# EAGLE design LV Parallel IO Card (EAGLE 4.16)
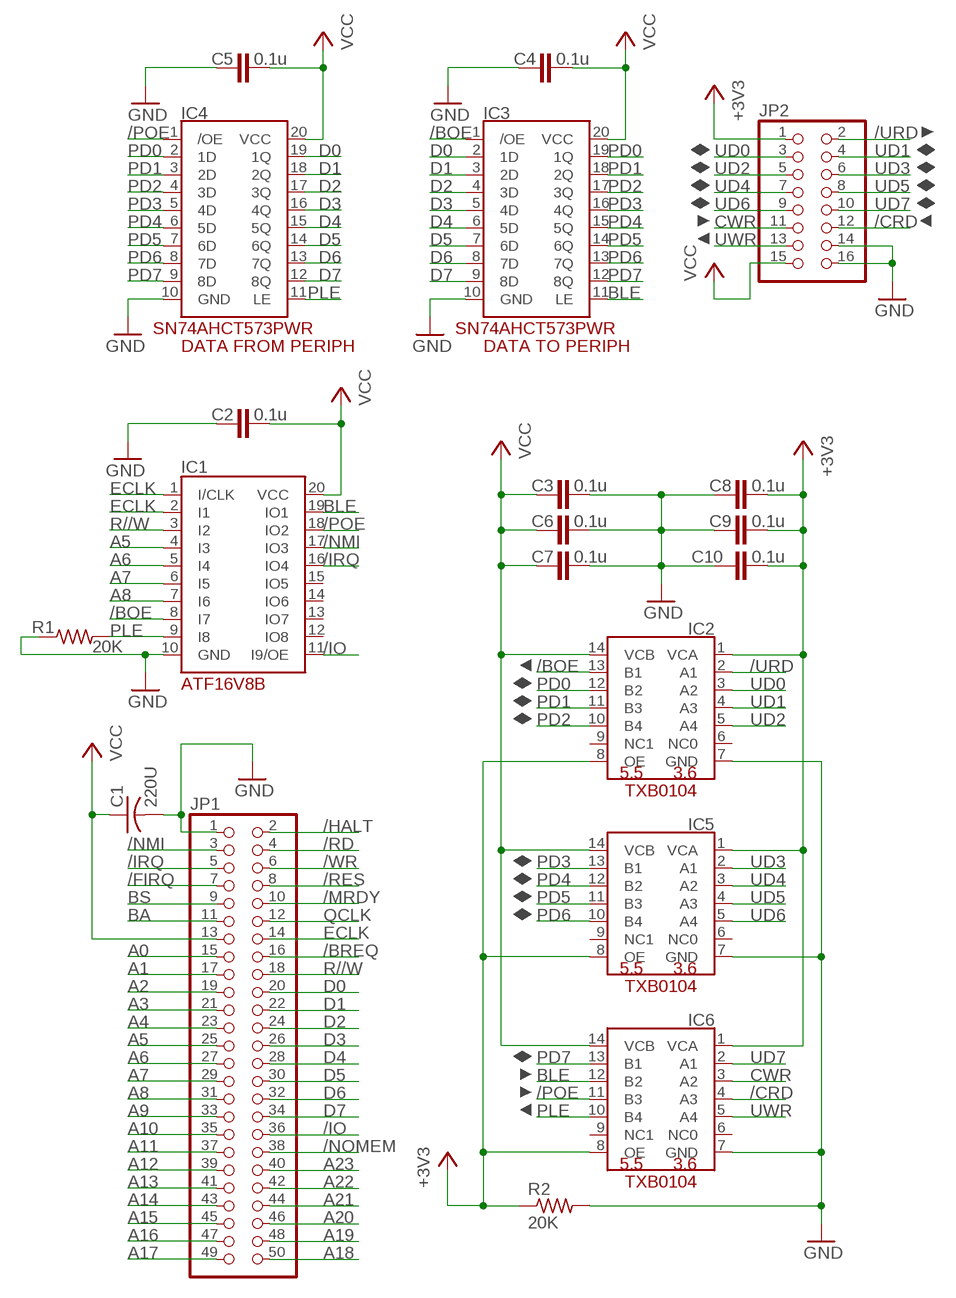
[diagram p0: schematic, sheet 1]

## Parts
C1  220U  C-USC0805  [C0805]
C2  0.1u  C-EUC0603  [C0603]
C3  0.1u  C-EUC0603  [C0603]
C4  0.1u  C-EUC0603  [C0603]
C5  0.1u  C-EUC0603  [C0603]
C6  0.1u  C-EUC0603  [C0603]
C7  0.1u  C-EUC0603  [C0603]
C8  0.1u  C-EUC0603  [C0603]
C9  0.1u  C-EUC0603  [C0603]
C10  0.1u  C-EUC0603  [C0603]
IC1  PLD_ATF16V8B  [DIL20]
IC2  TXB0104D  [SOIC14]
IC3  SN74AHCT573PWR  [TSSOP20]
IC4  SN74AHCT573PWR  [TSSOP20]
IC5  TXB0104D  [SOIC14]
IC6  TXB0104D  [SOIC14]
JP1  PINHD-2X25  [2X25]
JP2  PINHD-2X8  [2X08]
R1  20K  R-US_R0603  [R0603]
R2  20K  R-US_R0603  [R0603]

## Nets
+3V3: C8.2 C9.2 C10.2 IC2.1(VCA) IC2.8(OE) IC5.1(VCA) IC5.8(OE) IC6.1(VCA) IC6.8(OE) JP2.1 R2.1
/BOE: IC1.8(I7) IC2.13(B1) IC3.1(/OE)
/BREQ: JP1.16
/CRD: IC6.4(A3) JP2.12
/FIRQ: JP1.7
/HALT: JP1.2
/IO: IC1.11(I9/OE) JP1.36
/IRQ: IC1.16(IO4) JP1.5
/MRDY: JP1.10
/NMI: IC1.17(IO3) JP1.3
/NOMEM: JP1.38
/POE: IC1.18(IO2) IC4.1(/OE) IC6.11(B3)
/RD: JP1.4
/RES: JP1.8
/URD: IC2.2(A1) JP2.2
/WR: JP1.6
A0: JP1.15
A1: JP1.17
A2: JP1.19
A3: JP1.21
A4: JP1.23
A5: IC1.4(I3) JP1.25
A6: IC1.5(I4) JP1.27
A7: IC1.6(I5) JP1.29
A8: IC1.7(I6) JP1.31
A9: JP1.33
A10: JP1.35
A11: JP1.37
A12: JP1.39
A13: JP1.41
A14: JP1.43
A15: JP1.45
A16: JP1.47
A17: JP1.49
A18: JP1.50
A19: JP1.48
A20: JP1.46
A21: JP1.44
A22: JP1.42
A23: JP1.40
BA: JP1.11
BLE: IC1.19(IO1) IC3.11(LE) IC6.12(B2)
BS: JP1.9
CWR: IC6.3(A2) JP2.11
D0: IC3.2(1D) IC4.19(1Q) JP1.20
D1: IC3.3(2D) IC4.18(2Q) JP1.22
D2: IC3.4(3D) IC4.17(3Q) JP1.24
D3: IC3.5(4D) IC4.16(4Q) JP1.26
D4: IC3.6(5D) IC4.15(5Q) JP1.28
D5: IC3.7(6D) IC4.14(6Q) JP1.30
D6: IC3.8(7D) IC4.13(7Q) JP1.32
D7: IC3.9(8D) IC4.12(8Q) JP1.34
ECLK: IC1.1(I/CLK) IC1.2(I1) JP1.14
GND: C1.2 C2.1 C3.2 C4.1 C5.1 C6.2 C7.2 C8.1 C9.1 C10.1 IC1.10(GND) IC2.7(GND) IC3.10(GND) IC4.10(GND) IC5.7(GND) IC6.7(GND) JP1.1 JP2.14 JP2.16 R1.1 R2.2
PD0: IC2.12(B2) IC3.19(1Q) IC4.2(1D)
PD1: IC2.11(B3) IC3.18(2Q) IC4.3(2D)
PD2: IC2.10(B4) IC3.17(3Q) IC4.4(3D)
PD3: IC3.16(4Q) IC4.5(4D) IC5.13(B1)
PD4: IC3.15(5Q) IC4.6(5D) IC5.12(B2)
PD5: IC3.14(6Q) IC4.7(6D) IC5.11(B3)
PD6: IC3.13(7Q) IC4.8(7D) IC5.10(B4)
PD7: IC3.12(8Q) IC4.9(8D) IC6.13(B1)
PLE: IC1.9(I8) IC4.11(LE) IC6.10(B4) R1.2
QCLK: JP1.12
R//W: IC1.3(I2) JP1.18
UD0: IC2.3(A2) JP2.3
UD1: IC2.4(A3) JP2.4
UD2: IC2.5(A4) JP2.5
UD3: IC5.2(A1) JP2.6
UD4: IC5.3(A2) JP2.7
UD5: IC5.4(A3) JP2.8
UD6: IC5.5(A4) JP2.9
UD7: IC6.2(A1) JP2.10
UWR: IC6.5(A4) JP2.13
VCC: C1.1 C2.2 C3.1 C4.2 C5.2 C6.1 C7.1 IC1.20(VCC) IC2.14(VCB) IC3.20(VCC) IC4.20(VCC) IC5.14(VCB) IC6.14(VCB) JP1.13 JP2.15
Unconnected: IC1.12(IO8) IC1.13(IO7) IC1.14(IO6) IC1.15(IO5) IC2.6(NC0) IC2.9(NC1) IC5.6(NC0) IC5.9(NC1) IC6.6(NC0) IC6.9(NC1)

## Notes on the sheet
- DATA FROM PERIPH | DATA TO PERIPH

## Library data of the parts
C1 = rcl:C-US: CAPACITOR, American symbol
C2-C10 = rcl:C-EU: CAPACITOR, European symbol
IC1 = 07-Retrocomputing:PLD_ATF16V8B
IC2 IC5 IC6 = 07-Retrocomputing:TXB0104
IC3 IC4 = 07-Retrocomputing:SN74AHCT573PWR
JP1 = pinhead:PINHD-2X25: PIN HEADER
JP2 = pinhead:PINHD-2X8: PIN HEADER
R1 R2 = rcl:R-US_: RESISTOR, American symbol

## Net classes
0 default: width 0.203 mm, drill 0.203 mm, clearance 0.254 mm
1 supply: width 0.61 mm, drill 0.203 mm, clearance 0.305 mm

## Board
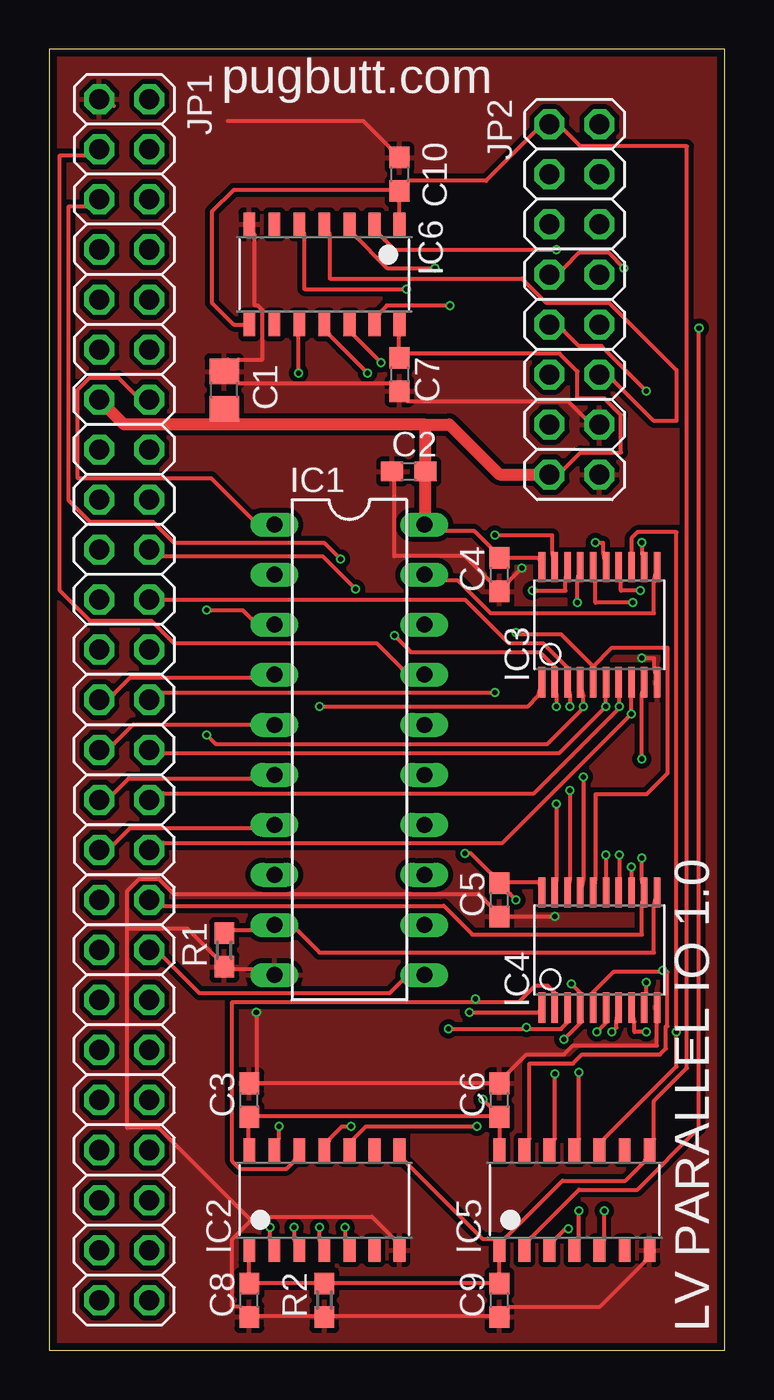
[diagram p1: board, top side]
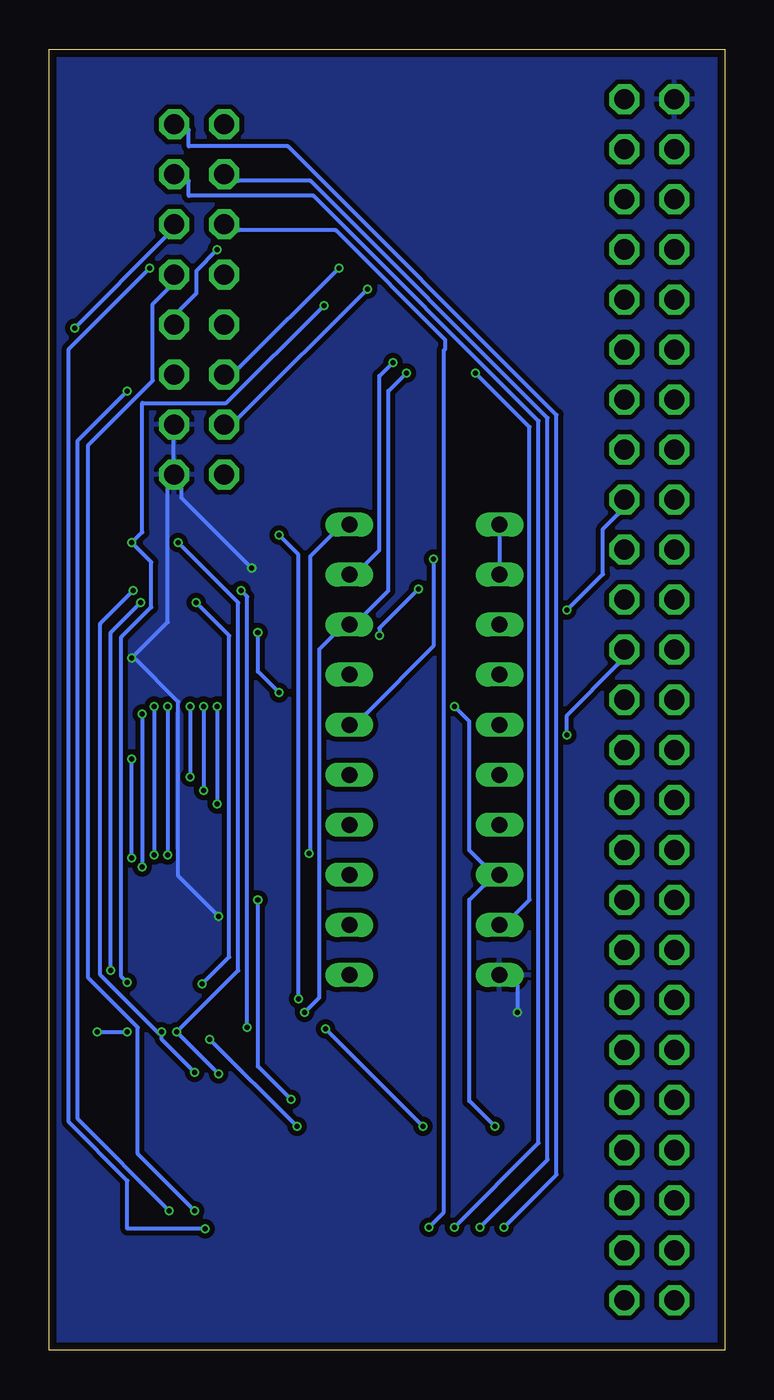
[diagram p2: board, bottom side, seen from below]

Size 34.29 x 66.04 mm. Coordinates in mm from the lower left corner, seen from the top.
Outline: 0,0 34.29,0 34.29,66.04 0,66.04 0,0
Copper layers (1*2*15*16): Top 0.0356mm / dielectric 0.1702mm / Route2 0.0178mm / dielectric 1.1938mm / Route15 0.0178mm / dielectric 0.1702mm / Bottom 0.0356mm
Design rules "oshpark-4layer": minimum track width 5mil, minimum drill 10mil, track to track 5mil, track to pad 5mil, pad to pad 5mil, via to via 5mil, smd to smd 5mil, copper to edge 15mil, drill to drill 6mil, minimum pad ring 4mil, minimum via ring 4mil, stop-mask expansion 2.5mil, vias tented up to drill 0mil, thermal gap 10mil

### Footprints (pad centres in the part's own frame; a part is rotated, then mirrored left to right if it is on the bottom)
C0805 = smd 1.3 x 1.5: 1 -0.95,0; 2 0.95,0
C0603 = smd 1.1 x 1: 1 -0.85,0; 2 0.85,0
DIL20 = drill 0.813 long: 1 -11.43,-3.81; 2 -8.89,-3.81; 3 -6.35,-3.81; 4 -3.81,-3.81; 5 -1.27,-3.81; 6 1.27,-3.81; 7 3.81,-3.81; 8 6.35,-3.81; 9 8.89,-3.81; 10 11.43,-3.81; 11 11.43,3.81; 12 8.89,3.81; 13 6.35,3.81; 14 3.81,3.81; 15 1.27,3.81; 16 -1.27,3.81; 17 -3.81,3.81; 18 -6.35,3.81; 19 -8.89,3.81; 20 -11.43,3.81
SOIC14 = smd 1.2 x 0.6: 1 -2.54,3.81; 2 -2.54,2.54; 3 -2.54,1.27; 4 -2.54,0; 5 -2.54,-1.27; 6 -2.54,-2.54; 7 -2.54,-3.81; 8 2.54,-3.81; 9 2.54,-2.54; 10 2.54,-1.27; 11 2.54,0; 12 2.54,1.27; 13 2.54,2.54; 14 2.54,3.81
TSSOP20 = smd 1.5 x 0.35: 1 -2.925,2.925; 2 -2.925,2.275; 3 -2.925,1.625; 4 -2.925,0.975; 5 -2.925,0.325; 6 -2.925,-0.325; 7 -2.925,-0.975; 8 -2.925,-1.625; 9 -2.925,-2.275; 10 -2.925,-2.925; 11 2.925,-2.925; 12 2.925,-2.275; 13 2.925,-1.625; 14 2.925,-0.975; 15 2.925,-0.325; 16 2.925,0.325; 17 2.925,0.975; 18 2.925,1.625; 19 2.925,2.275; 20 2.925,2.925
2X25 = drill 1.016 octagon: 1 -30.48,-1.27; 2 -30.48,1.27; 3 -27.94,-1.27; 4 -27.94,1.27; 5 -25.4,-1.27; 6 -25.4,1.27; 7 -22.86,-1.27; 8 -22.86,1.27; 9 -20.32,-1.27; 10 -20.32,1.27; 11 -17.78,-1.27; 12 -17.78,1.27; 13 -15.24,-1.27; 14 -15.24,1.27; 15 -12.7,-1.27; 16 -12.7,1.27; 17 -10.16,-1.27; 18 -10.16,1.27; 19 -7.62,-1.27; 20 -7.62,1.27; 21 -5.08,-1.27; 22 -5.08,1.27; 23 -2.54,-1.27; 24 -2.54,1.27; 25 0,-1.27; 26 0,1.27; 27 2.54,-1.27; 28 2.54,1.27; 29 5.08,-1.27; 30 5.08,1.27; 31 7.62,-1.27; 32 7.62,1.27; 33 10.16,-1.27; 34 10.16,1.27; 35 12.7,-1.27; 36 12.7,1.27; 37 15.24,-1.27; 38 15.24,1.27; 39 17.78,-1.27; 40 17.78,1.27; 41 20.32,-1.27; 42 20.32,1.27; 43 22.86,-1.27; 44 22.86,1.27; 45 25.4,-1.27; 46 25.4,1.27; 47 27.94,-1.27; 48 27.94,1.27; 49 30.48,-1.27; 50 30.48,1.27
2X08 = drill 1.016 octagon: 1 -8.89,-1.27; 2 -8.89,1.27; 3 -6.35,-1.27; 4 -6.35,1.27; 5 -3.81,-1.27; 6 -3.81,1.27; 7 -1.27,-1.27; 8 -1.27,1.27; 9 1.27,-1.27; 10 1.27,1.27; 11 3.81,-1.27; 12 3.81,1.27; 13 6.35,-1.27; 14 6.35,1.27; 15 8.89,-1.27; 16 8.89,1.27
R0603 = smd 1.1 x 1: 1 -0.85,0; 2 0.85,0

### Placement (x,y rotation side)
C1  8.89,48.74 90 top
C2  18.26,44.61 0 top
C3  10.16,12.7 90 top
C4  22.86,39.37 90 top
C5  22.86,22.86 90 top
C6  22.86,12.7 90 top
C7  17.78,49.53 270 top
C8  10.16,2.54 90 top
C9  22.86,2.54 90 top
C10  17.78,59.69 270 top
IC1  15.24,30.48 270 top
IC2  13.97,7.62 90 top
IC3  27.94,36.83 90 top
IC4  27.94,20.32 90 top
IC5  26.67,7.62 90 top
IC6  13.97,54.61 270 top
JP1  3.81,33.02 270 top
JP2  26.67,53.34 270 top
R1  8.89,20.32 90 top
R2  13.97,2.54 270 top

### Tracks (layer width: path | path; a pad name or v marks a point on that pad's centre or on a via)
+3V3
  Top 0.203: IC2.1 10.13,4.5 10.13,3.89 C8.2 10.59,3.43 13.49,3.43 R2.1 14.4,3.43 22.4,3.43 C9.2 IC5.1 | IC2.8 18.06,9.6 22.02,5.64 22.63,5.64 IC5.1 | IC5.1 23.09,5.64 26.06,8.61 29.26,8.61 30.25,9.6 IC5.8 30.71,10.74 30.71,12.65 32.38,14.33 32.38,61.11 26.98,61.11 26.14,61.95 JP2.1 24.69,61.87 22.17,59.36 18.21,59.36 C10.2 | C10.2 17.75,58.29 17.75,57.68 IC6.1 | IC6.8 9.37,52.07 8.26,53.18 8.26,57.78 9.37,58.9 17.78,58.9 C10.2
/BOE  (via drill 0.25)
  Top 0.203: v11.66,11.35 11.66,10.74 IC2.13 | v13.72,32.69 24.31,32.69 24.84,33.22 IC3.1
  Bottom 0.203: v11.66,11.35 12.95,12.65 12.95,22.86 12.27,23.55 IC1.8 12.27,24.69 12.95,25.38 12.95,31.93 v13.72,32.69
/CRD
  Top 0.203: IC6.4 14.25,56.62 14.25,54.41 24,54.41 25.22,53.19 28.42,53.19 31.85,49.76 31.85,47.17 30.71,47.17 28.65,49.23 JP2.12
/IO
  Top 0.203: IC1.11 17.91,18.75 17.3,18.14 7.62,18.14 5.79,19.96 JP1.36
/IRQ  (via drill 0.25)
  Top 0.203: v14.78,40.16 13.95,41 6.33,41 5.26,42.06 2.06,42.06 0.99,43.13 0.99,58.06 1.83,58.06 JP1.5
  Bottom 0.203: v14.78,40.16 14.78,35.74 18.21,32.31 IC1.16
/NMI
  Top 0.203: IC1.17 17.91,34.59 16.61,35.89 6.33,35.89 5.18,37.03 2.06,37.03 0.53,38.56 0.53,60.66 1.83,60.66 JP1.3
/POE  (via drill 0.25)
  Top 0.203: v16.15,49.61 14.25,51.51 IC6.11 | v21.34,17.14 24.84,17.14 IC4.1
  Bottom 0.203: v16.15,49.61 17.07,48.69 17.07,38.56 18.21,37.41 IC1.18 19.89,36.27 20.57,35.59 20.57,17.91 v21.34,17.14
/URD  (via drill 0.25)
  Top 0.203: v11.2,6.25 11.2,5.64 IC2.2
  Bottom 0.203: v11.2,6.25 8.53,8.91 8.53,47.47 22.17,61.11 27.2,61.11 27.2,61.95 JP2.2
A5
  Top 0.203: IC1.4 10.29,34.14 4.12,34.14 3.28,33.3 JP1.25
A6
  Top 0.203: IC1.5 10.29,31.77 4.27,31.77 3.28,30.79 JP1.27
A7
  Top 0.203: IC1.6 10.29,29.03 4.04,29.03 3.28,28.27 JP1.29
A8
  Top 0.203: IC1.7 10.29,26.52 4.12,26.52 3.28,25.68 JP1.31
BLE  (via drill 0.25)
  Top 0.203: v16.84,50.14 15.47,51.51 IC6.12 | IC3.11 30.71,39.01 30.71,37.41 22.4,37.41 20.73,39.09 20.19,39.09 IC1.19
  Bottom 0.203: v16.84,50.14 17.53,49.45 17.53,40.62 18.21,39.93 IC1.19
CWR  (via drill 0.25)
  Top 0.203: v19.58,54.94 17.14,54.94 15.47,56.62 IC6.3
  Bottom 0.203: v19.58,54.94 24.69,49.84 JP2.11
D0  (via drill 0.25)
  Top 0.203: v25.76,27.74 25.76,23.93 IC4.19 | v25.76,32.69 25.76,33.22 IC3.2 25.76,34.59 24.92,35.43 18.36,35.43 v17.53,36.27 | v15.54,38.63 13.87,40.31 5.79,40.31 JP1.20
  Bottom 0.203: v25.76,32.69 v25.76,27.74 | v15.54,38.63 17.53,36.65 v17.53,36.27
D1  (via drill 0.25)
  Top 0.203: v26.44,28.42 26.44,23.93 IC4.18 | v26.44,32.69 26.44,33.22 IC3.3 26.36,34.59 25.07,35.89 23.32,35.89 21.11,38.1 JP1.22
  Bottom 0.203: v26.44,32.69 v26.44,28.42
D2  (via drill 0.25)
  Top 0.203: v27.13,29.11 27.13,23.93 IC4.17 | IC3.4 27.13,33.22 v27.13,32.69 27.05,32.54 25.3,30.79 8.46,30.79 v8,31.24
  Bottom 0.203: v27.13,32.69 v27.13,29.11 | v8,31.24 8,32.23 5.41,34.82 JP1.24
D3  (via drill 0.25)
  Top 0.203: 27.62,34.71 27.51,34.59 IC3.5 | 27.62,34.71 28.57,35.66 31.39,35.66 31.39,29.29 30.33,28.22 27.74,28.22 27.74,23.93 IC4.16 | v22.63,33.38 5.79,33.38 JP1.26 | v23.7,36.42 23.77,36.35 25.98,36.35 27.62,34.71
  Bottom 0.203: v22.63,33.38 23.7,34.44 v23.7,36.42
D4  (via drill 0.25)
  Top 0.203: v28.27,25.15 28.27,23.93 IC4.15 | IC3.6 28.27,33.22 v28.27,32.69 25.91,30.33 5.79,30.33 JP1.28
  Bottom 0.203: v28.27,32.69 v28.27,25.15
D5  (via drill 0.25)
  Top 0.203: v28.96,25.15 28.96,23.93 IC4.14 | IC3.7 28.96,33.22 v28.96,32.69 28.88,32.54 24.61,28.27 5.79,28.27 JP1.30
  Bottom 0.203: v28.96,32.69 v28.96,25.15
D6  (via drill 0.25)
  Top 0.203: v29.57,24.54 29.57,23.93 IC4.13 | IC3.8 29.57,33.22 v29.57,32.31 23.01,25.76 5.79,25.76 JP1.32
  Bottom 0.203: v29.57,32.31 v29.57,24.54
D7  (via drill 0.25)
  Top 0.203: JP1.34 5.79,22.55 20.04,22.55 21.49,21.11 30.1,21.11 30.1,22.55 IC4.12 30.1,23.93 v30.1,24.99 | v30.1,30.02 30.1,33.22 IC3.9
  Bottom 0.203: v30.1,24.99 v30.1,30.02
ECLK
  Top 0.203: JP1.14 4.34,48.54 3.5,49.38 2.06,49.38 1.45,48.77 1.45,44.27 8.23,44.27 10.29,42.22 IC1.1
  Bottom 0.203: IC1.1 IC1.2
GND  (via drill 0.25)
  Top 0.203: IC4.10 30.86,16.69 30.86,15.47 26.59,15.47 26.14,15.01 24.23,15.01 23.32,14.1 C6.2 22.4,13.56 10.59,13.56 C3.2 10.52,14.1 v10.52,17.14 | IC1.10 10.29,19.36 9.37,19.36 R1.1 8.46,19.96 7.01,21.41 3.96,21.41 | 3.96,21.41 3.96,23.32 4.57,23.93 5.56,23.93 6.33,23.16 21.79,23.16 22.4,22.55 C5.1 23.32,22.02 v25.68,22.02 | 10.25,6.59 9.3,5.64 9.3,2.21 9.68,2.21 C8.1 10.59,1.75 13.49,1.75 R2.2 14.4,1.75 22.4,1.75 C9.1 23.32,2.21 27.96,2.21 30.25,4.5 IC5.7 | 10.25,6.59 10.44,6.78 16.38,6.78 17.53,5.64 IC2.7 | 3.96,21.41 3.96,11.28 5.56,11.28 10.25,6.59 | v24,39.7 23.32,39.01 C4.1 22.4,39.01 21.11,40.31 17.53,40.31 17.53,44.12 C2.1 | v30.1,35.13 30.71,35.13 30.71,34.59 IC3.10 | 9.07,62.41 15.93,62.41 17.3,61.04 C10.1 | 3.28,63.17 JP1.1 | IC6.7 10.44,56.62 10.44,53.03 10.59,53.03 10.82,52.81 10.82,50.29 9.6,50.29 C1.2 | C1.2 9.6,49.07 17.3,49.07 C7.2 18.21,48.16 26.36,48.16 27.2,47.32 JP2.14 | C1.2 9.07,50.29
  Bottom 0.203: v10.52,17.14 10.52,18.52 IC1.10 | v24,39.7 27.58,43.28 27.58,43.74 JP2.16 | JP2.16 28.27,43.74 28.27,36.96 v30.1,35.13 29.95,35.13 27.74,32.92 27.74,24.08 v25.68,22.02 | JP2.14 27.96,46.25 27.96,45.19 JP2.16
  pour Bottom: 34.29,66.04 34.29,0 0,0 0,66.04
  pour Top: 0,66.04 0,0 34.29,0 34.29,66.04
PD0  (via drill 0.25)
  Top 0.203: 21.64,17.68 23.85,17.68 24.69,18.52 25.3,18.52 25.68,18.14 IC4.2 | 21.64,17.68 9.3,17.68 9.3,9.6 9.68,9.22 12.04,9.22 12.42,9.6 IC2.12 | v22.63,41.38 25.53,41.38 25.53,40.46 IC3.19 | 21.64,17.68 v21.64,17.83
  Bottom 0.203: v22.63,41.38 21.64,40.39 v21.64,17.83
PD1  (via drill 0.25)
  Top 0.203: v15.32,11.35 14.86,11.35 14.25,10.74 IC2.11 | 24.23,16.31 25.98,16.31 26.36,16.69 IC4.3 | v20.27,16.31 24.23,16.31 | v24.54,38.56 26.21,38.56 26.21,39.01 IC3.18 | 24.23,16.31 v24.23,16.38
  Bottom 0.203: v15.32,11.35 v20.27,16.31 | v24.54,38.56 24.23,38.25 v24.23,16.38
PD2  (via drill 0.25)
  Top 0.203: v21.72,11.35 16.08,11.35 15.47,10.74 IC2.10 | v26.14,15.77 27.05,16.69 IC4.4 26.98,18.14 v26.52,18.59 | v26.82,37.95 26.82,39.01 IC3.17
  Bottom 0.203: v21.72,11.35 v26.14,15.77 | v26.82,37.95 25.15,36.27 25.15,19.96 v26.52,18.59
PD3  (via drill 0.25)
  Top 0.203: 31.17,19.2 28.65,19.2 27.58,18.14 IC4.5 | 31.17,19.2 31.39,19.2 31.39,16.46 31.32,16.46 31.32,15.32 31.01,15.01 27.05,15.01 26.59,14.55 24.38,14.55 24.38,10.74 IC5.13 | v29.64,37.95 27.74,37.95 27.74,39.01 IC3.16 | 31.17,19.2 v31.17,19.28
  Bottom 0.203: v29.64,37.95 31.17,36.42 v31.17,19.28
PD4  (via drill 0.25)
  Top 0.203: v25.68,14.02 25.68,10.74 IC5.12 | v27.81,16.15 28.35,16.69 IC4.6 | v27.74,41 28.12,41 28.12,40.46 IC3.15
  Bottom 0.203: v25.68,14.02 v27.81,16.15 24.69,19.28 24.69,37.95 v27.74,41
PD5  (via drill 0.25)
  Top 0.203: v26.9,14.1 26.9,10.74 IC5.11 | v28.57,16.15 28.8,16.38 28.8,16.69 IC4.7 | v30.02,38.56 29.03,38.56 29.03,39.01 IC3.14
  Bottom 0.203: v26.9,14.1 28.57,15.77 v28.57,16.15 28.73,16.08 31.7,19.05 31.7,36.88 v30.02,38.56
PD6  (via drill 0.25)
  Top 0.203: IC5.10 28.19,10.74 31.85,14.4 v31.85,16.15 31.85,41.53 29.87,41.53 29.57,41.22 29.57,40.46 IC3.13 | v30.33,16.15 29.72,16.15 29.72,16.69 IC4.8
  Bottom 0.203: v31.85,16.15 v30.33,16.15
PD7  (via drill 0.25)
  Top 0.203: v20.34,53.03 17.14,53.03 16.76,52.65 IC6.13 | v30.1,41 30.1,40.46 IC3.12 | v30.33,18.67 30.33,18.14 IC4.9
  Bottom 0.203: v20.34,53.03 25.3,48.08 29.57,48.08 29.57,41.53 v30.1,41 29.11,40.01 29.11,37.72 30.63,36.2 30.63,18.97 v30.33,18.67
PLE  (via drill 0.25)
  Top 0.203: R1.2 9.37,21.34 10.29,21.34 IC1.9 12.57,21.34 13.72,20.19 30.71,20.19 30.71,22.55 IC4.11 | v12.65,49.61 12.65,51.51 IC6.10
  Bottom 0.203: v12.65,49.61 9.91,46.86 9.91,22.86 10.59,22.17 IC1.9
R//W  (via drill 0.25)
  Top 0.203: v8,37.57 9.83,37.57 10.29,37.11 IC1.3
  Bottom 0.203: v8,37.57 6.17,39.4 6.17,41.68 5.41,42.44 JP1.18
UD0  (via drill 0.25)
  Top 0.203: v12.42,6.25 12.42,5.64 IC2.3
  Bottom 0.203: v12.42,6.25 8.99,9.68 8.99,47.32 21.03,59.36 24.69,59.36 JP2.3
UD1  (via drill 0.25)
  Top 0.203: v13.72,6.25 13.72,5.64 IC2.4
  Bottom 0.203: v13.72,6.25 9.45,10.52 9.45,47.17 20.88,58.6 27.2,58.6 27.2,59.36 JP2.4
UD2  (via drill 0.25)
  Top 0.203: v15.01,6.25 15.01,5.64 IC2.5
  Bottom 0.203: v15.01,6.25 14.25,7.01 14.25,50.75 14.17,50.83 14.17,51.28 19.74,56.84 24.69,56.84 JP2.5
UD3  (via drill 0.25)
  Top 0.203: v32.99,51.89 32.99,11.28 29.87,8.15 26.9,8.15 24.38,5.64 IC5.2
  Bottom 0.203: v32.99,51.89 28.35,56.54 JP2.6
UD4  (via drill 0.25)
  Top 0.203: v26.36,6.17 26.21,6.17 25.68,5.64 IC5.3 | v29.18,54.94 28.42,55.7 26.9,55.7 26.14,54.94 JP2.7
  Bottom 0.203: v26.36,6.17 30.33,6.17 30.33,8.61 33.3,11.58 33.3,50.83 v29.18,54.94
UD5  (via drill 0.25)
  Top 0.203: v26.9,7.09 26.9,5.64 IC5.4
  Bottom 0.203: v26.9,7.09 29.79,9.98 29.79,16.38 32.31,18.9 32.31,45.95 29.03,49.23 29.03,53.11 28.27,53.87 JP2.8
UD6  (via drill 0.25)
  Top 0.203: v28.19,7.09 28.19,5.64 IC5.5 | v30.33,48.69 28.04,50.98 26.9,50.98 26.14,51.74 JP2.9
  Bottom 0.203: v28.19,7.09 32.84,11.73 32.84,46.18 v30.33,48.69
UD7  (via drill 0.25)
  Top 0.203: v25.76,55.85 17.53,55.85 16.76,56.62 IC6.2
  Bottom 0.203: v25.76,55.85 26.82,54.79 26.82,53.65 27.66,52.81 JP2.10
UWR  (via drill 0.25)
  Top 0.203: v18.14,53.87 12.95,53.87 12.95,56.62 IC6.5
  Bottom 0.203: v18.14,53.87 24.69,47.32 JP2.13
VCC  (via drill 0.25)
  Top 0.203: IC6.14 17.75,51.51 17.75,50.9 C7.1 18.21,50.6 25.91,50.6 26.82,49.68 26.82,48.31 28.19,48.31 29.03,47.47 29.03,45.57 26.98,45.57 26.14,44.73 JP2.15 | IC2.14 10.13,10.74 10.13,11.35 C3.1 10.59,11.89 22.4,11.89 C6.1 | C6.1 IC5.14 | IC3.20 24.84,40.23 23.32,40.23 C4.2 22.4,40.77 21.57,41.6 20.19,41.6 IC1.20 | C5.2 23.32,23.77 24.84,23.77 IC4.20 | v21.11,25.22 21.41,25.22 22.4,24.23 C5.2 | v22.02,12.72 22.4,12.34 C6.1 | v23.7,22.86 23.39,23.16 23.32,23.16 C5.2
  Top 0.61: JP1.13 3.81,46.99 8.89,46.99 | 8.89,46.99 C1.1 | JP2.15 22.86,44.45 20.32,46.99 19.05,46.99 | 19.05,46.99 8.89,46.99 | IC1.20 19.11,41.97 C2.2 19.11,46.93 19.05,46.99
  Bottom 0.203: v21.11,25.22 21.03,25.3 21.03,40.31 19.96,41.38 IC1.20 | v22.02,12.72 23.7,14.4 v23.7,22.86

### Text on the board
tPlace: pugbutt.com | LV PARALLEL IO 1.0